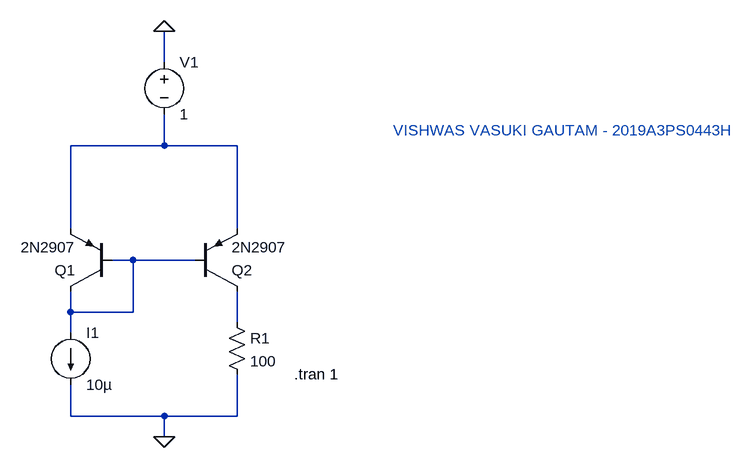
[diagram p0: schematic Current_Mirror_PNP.asc]
Current_Mirror_PNP.asc, the LTspice schematic file:
Version 4
SHEET 1 880 680
WIRE -272 -352 -272 -400
WIRE -272 -224 -272 -272
WIRE -272 -224 -416 -224
WIRE -160 -224 -272 -224
WIRE -416 -96 -416 -224
WIRE -160 -96 -160 -224
WIRE -320 -48 -352 -48
WIRE -224 -48 -320 -48
WIRE -416 32 -416 0
WIRE -320 32 -320 -48
WIRE -320 32 -416 32
WIRE -160 48 -160 0
WIRE -416 64 -416 32
WIRE -416 192 -416 144
WIRE -272 192 -416 192
WIRE -160 192 -160 128
WIRE -160 192 -272 192
WIRE -272 224 -272 192
FLAG -272 -400 0
FLAG -272 224 0
SYMBOL pnp -352 0 R180
SYMATTR InstName Q1
SYMATTR Value 2N2907
SYMBOL pnp -224 0 M180
SYMATTR InstName Q2
SYMATTR Value 2N2907
SYMBOL voltage -272 -368 R0
WINDOW 123 0 0 Left 2
WINDOW 39 0 0 Left 2
SYMATTR InstName V1
SYMATTR Value 1
SYMBOL current -416 64 R0
WINDOW 123 0 0 Left 2
WINDOW 39 0 0 Left 2
SYMATTR InstName I1
SYMATTR Value 10µ
SYMBOL res -176 32 R0
SYMATTR InstName R1
SYMATTR Value 100
TEXT -72 128 Left 2 !.tran 1
TEXT 80 -248 Left 2 ;VISHWAS VASUKI GAUTAM - 2019A3PS0443H

The netlist it stands for:
* Current_Mirror_PNP.asc
Q1 N002 N002 N001 0 2N2907
Q2 N003 N002 N001 0 2N2907
V1 0 N001 1
I1 N002 0 10µ
R1 N003 0 100
.model NPN NPN
.model PNP PNP
.lib standard.bjt
.tran 1
* VISHWAS VASUKI GAUTAM - 2019A3PS0443H
.backanno
.end